# EAGLE schematic STM32F030 (EAGLE 6.5.0)
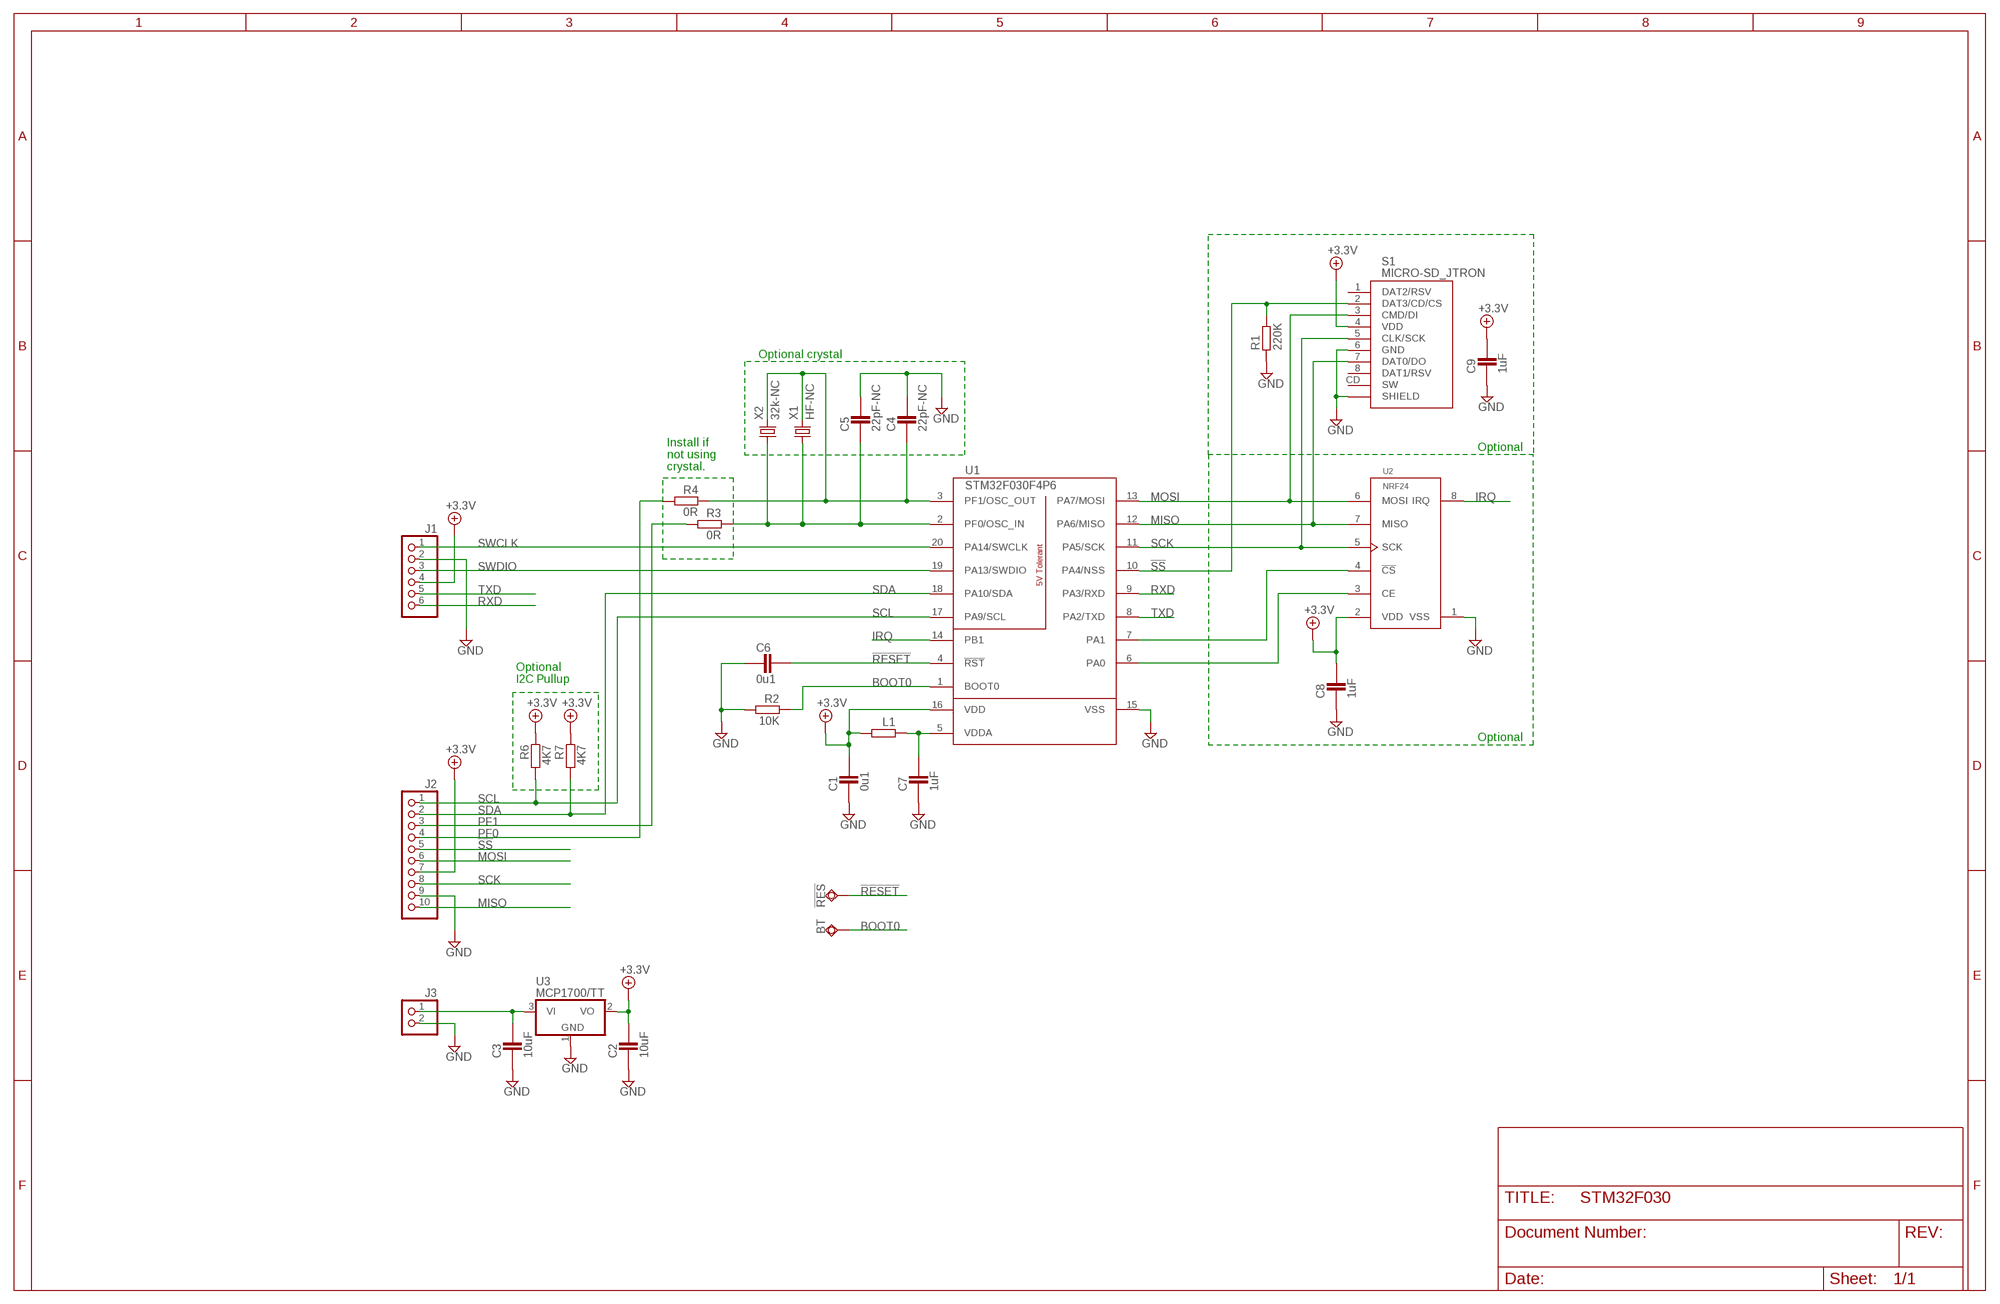
[diagram p0: schematic, sheet 1]

## Parts
!RES  TPSQTP08SQ  [TP08SQ]
BT  TPSQTP08SQ  [TP08SQ]
C1  0u1  CAPACITOR_0603  [CAPC1608X92N]
C2  10uF  CAPACITOR_0805  [CAPC2012X145AN]
C3  10uF  CAPACITOR_0805  [CAPC2012X145AN]
C4  22pF-NC  CAPACITOR_0603  [CAPC1608X92N]
C5  22pF-NC  CAPACITOR_0603  [CAPC1608X92N]
C6  0u1  CAPACITOR_0603  [CAPC1608X92N]
C7  1uF  CAPACITOR_0603  [CAPC1608X92N]
C8  1uF  CAPACITOR_0603  [CAPC1608X92N]
C9  1uF  CAPACITOR_0603  [CAPC1608X92N]
J1  PINHD-1X6  [1X06]
J2  PINHD-1X10  [1X10]
J3  PINHD-1X2_2.54  [1X02]
L1  RESISTOR_0603  [RESC1608X55N]
R1  220K  RESISTOR_0603  [RESC1608X55N]
R2  10K  RESISTOR_0603  [RESC1608X55N]
R3  0R  RESISTOR_0603  [RESC1608X55N]
R4  0R  RESISTOR_0603  [RESC1608X55N]
R6  4K7  RESISTOR_0603  [RESC1608X55N]
R7  4K7  RESISTOR_0603  [RESC1608X55N]
S1  MICRO-SD_JTRON  [JTRON-MICROSD]
U1  STM32F030F4P6  [TSSOP20]
U2  NRF24  [NRF24L01]
U3  MCP1700/TT  [SOT95P280X135-3N]
X1  HF-NC  CRYSTALSM49  [SM49]
X2  32k-NC  CRYSTALWATCH  [CRYSTAL32SMT]

## Nets
!RESET: !RES.TP C6.2 U1.4(!RST)
!SS: J2.5 R1.2 S1.2(DAT3/CD/CS) U1.10(PA4/NSS)
+3.3V: C1.2 C2.2 C8.2 C9.2 J1.4 J2.7 L1.2 R6.1 R7.1 S1.4(VDD) U1.16(VDD) U2.2(VDD) U3.2(VO)
BOOT0: BT.TP R2.1 U1.1(BOOT0)
GND: C1.1 C2.1 C3.1 C4.2 C5.2 C6.1 C7.1 C8.1 C9.1 J1.2 J2.9 J3.2 R1.1 R2.2 S1.6(GND) S1.SHIELD@1(SHIELD) S1.SHIELD@2(SHIELD) S1.SHIELD@3(SHIELD) S1.SHIELD@4(SHIELD) U1.15(VSS) U2.1(VSS) U3.1(GND)
IRQ: U1.14(PB1) U2.8(IRQ)
MISO: J2.10 S1.7(DAT0/DO) U1.12(PA6/MISO) U2.7(MISO)
MOSI: J2.6 S1.3(CMD/DI) U1.13(PA7/MOSI) U2.6(MOSI)
N$4: C7.2 L1.1 U1.5(VDDA)
N$7: C3.2 J3.1 U3.3(VI)
N$9: C4.1 R4.1 U1.3(PF1/OSC_OUT) X1.2 X2.2
N$10: C5.1 R3.1 U1.2(PF0/OSC_IN) X1.1 X2.1
N$17: U1.7(PA1) U2.4(!CS)
N$20: U1.6(PA0) U2.3(CE)
PF0: J2.4 R4.2
PF1: J2.3 R3.2
RXD: J1.6 U1.9(PA3/RXD)
SCK: J2.8 S1.5(CLK/SCK) U1.11(PA5/SCK) U2.5(SCK)
SCL: J2.1 R6.2 U1.17(PA9/SCL)
SDA: J2.2 R7.2 U1.18(PA10/SDA)
SWCLK: J1.1 U1.20(PA14/SWCLK)
SWDIO: J1.3 U1.19(PA13/SWDIO)
TXD: J1.5 U1.8(PA2/TXD)
Unconnected: S1.1(DAT2/RSV) S1.8(DAT1/RSV) S1.CD(SW)

## Notes on the sheet
- Optional crystal
- Optional
- Install if
  not using
  crystal.
- Optional
  I2C Pullup
- Optional

## Library data of the parts
!RES BT = testpad:TPSQ: Test pad
C1-C9 = ipc-7351-capacitor:CAPACITOR_
J1 = Misc Conn:PINHD-1X6: PIN HEADER
J2 = Misc Conn:PINHD-1X10: PIN HEADER
J3 = Misc Conn:PINHD-1X2: PIN HEADER
L1 R1-R4 R6 R7 = ipc-7351-resistor:RESISTOR_
S1 = Misc Conn:MICRO-SD_
U1 = Misc Processor:STM32F030F4P6
U2 = misc pcb:NRF24
U3 = Misc Power:MCP1700
X1 X2 = Misc Passives:CRYSTAL: CRYSTAL